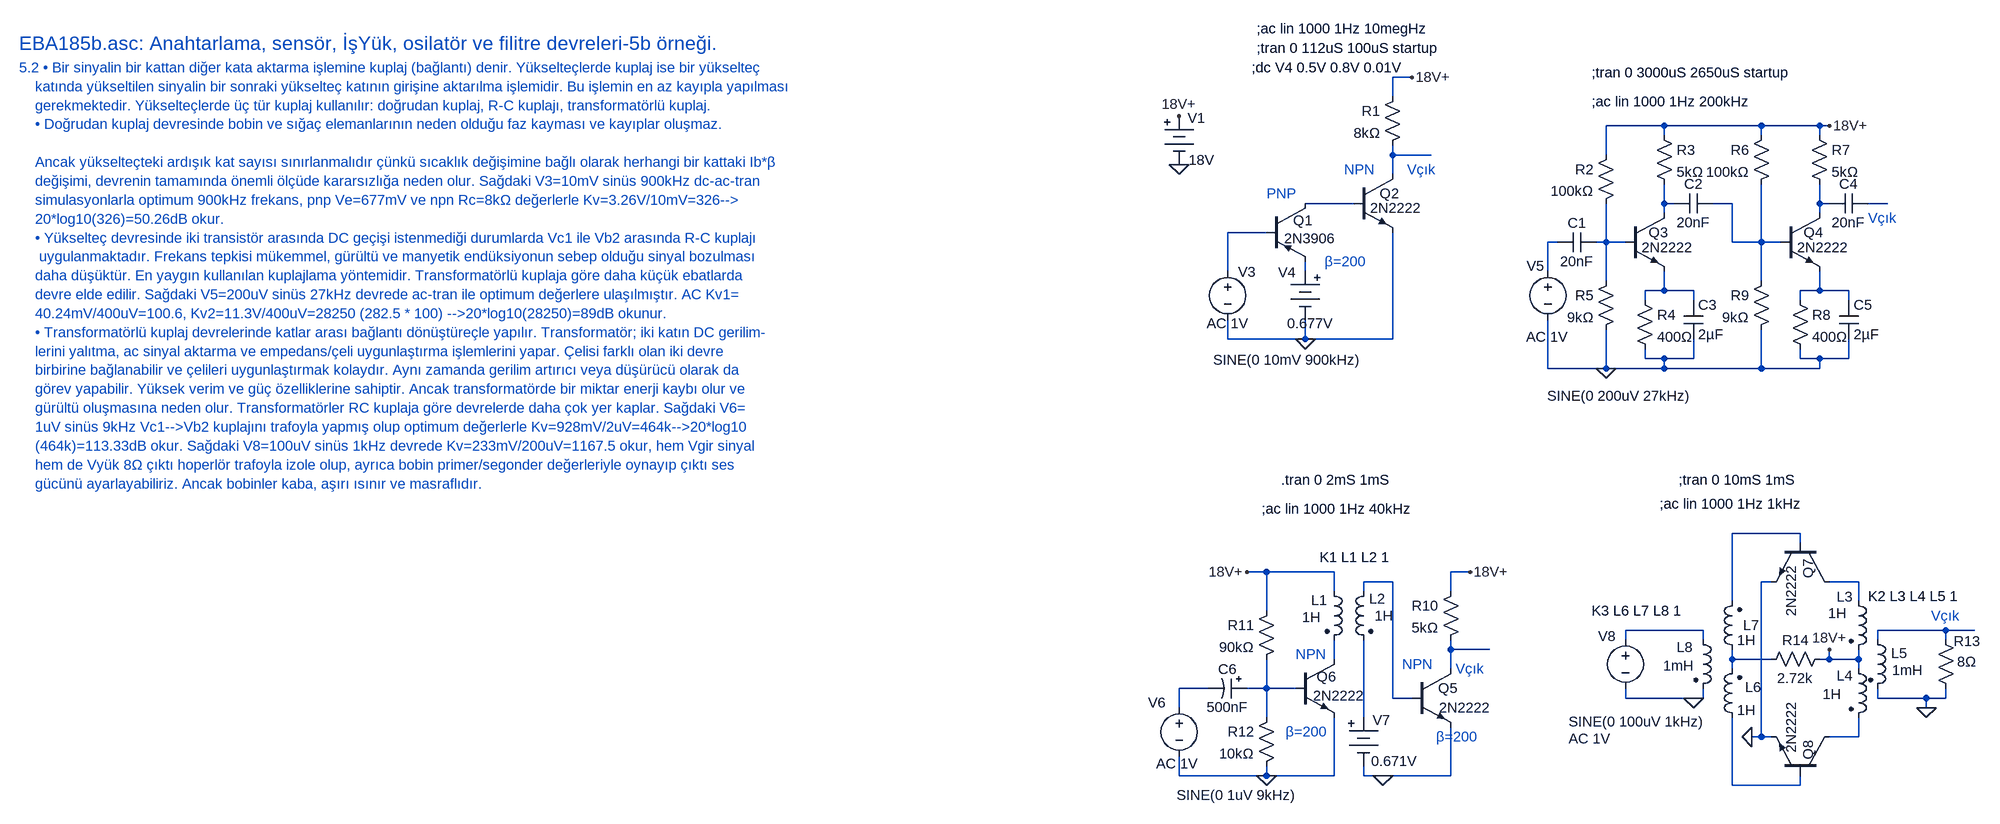
[diagram p0: schematic EBA185b.asc]
EBA185b.asc, the LTspice schematic file:
Version 4
SHEET 1 7064 4332
WIRE 2064 112 2032 112
WIRE 2032 144 2032 112
WIRE 2480 192 2384 192
WIRE 2640 192 2480 192
WIRE 2736 192 2640 192
WIRE 2752 192 2736 192
WIRE 2480 208 2480 192
WIRE 2640 208 2640 192
WIRE 2736 208 2736 192
WIRE 2032 240 2032 224
WIRE 2096 240 2032 240
WIRE 2384 240 2384 192
WIRE 2032 272 2032 240
WIRE 1968 320 1888 320
WIRE 2480 320 2480 288
WIRE 2496 320 2480 320
WIRE 2592 320 2560 320
WIRE 2736 320 2736 288
WIRE 2752 320 2736 320
WIRE 2848 320 2816 320
WIRE 2480 336 2480 320
WIRE 2736 336 2736 320
WIRE 1824 368 1760 368
WIRE 2304 384 2288 384
WIRE 2384 384 2384 320
WIRE 2384 384 2368 384
WIRE 2416 384 2384 384
WIRE 2592 384 2592 320
WIRE 2640 384 2640 288
WIRE 2640 384 2592 384
WIRE 2672 384 2640 384
WIRE 1760 432 1760 368
WIRE 1888 432 1888 416
WIRE 2288 432 2288 384
WIRE 2384 448 2384 384
WIRE 2640 448 2640 384
WIRE 2480 464 2480 432
WIRE 2480 464 2448 464
WIRE 2528 464 2480 464
WIRE 2736 464 2736 432
WIRE 2736 464 2704 464
WIRE 2784 464 2736 464
WIRE 2448 480 2448 464
WIRE 2528 480 2528 464
WIRE 2704 480 2704 464
WIRE 2784 480 2784 464
WIRE 1760 544 1760 512
WIRE 1888 544 1888 512
WIRE 1888 544 1760 544
WIRE 2032 544 2032 368
WIRE 2032 544 1888 544
WIRE 2448 576 2448 560
WIRE 2480 576 2448 576
WIRE 2528 576 2528 544
WIRE 2528 576 2480 576
WIRE 2704 576 2704 560
WIRE 2736 576 2704 576
WIRE 2784 576 2784 544
WIRE 2784 576 2736 576
WIRE 2288 592 2288 512
WIRE 2384 592 2384 528
WIRE 2384 592 2288 592
WIRE 2480 592 2480 576
WIRE 2480 592 2384 592
WIRE 2640 592 2640 528
WIRE 2640 592 2480 592
WIRE 2736 592 2736 576
WIRE 2736 592 2640 592
WIRE 2704 864 2592 864
WIRE 2704 880 2704 864
WIRE 1824 928 1792 928
WIRE 1936 928 1824 928
WIRE 2160 928 2128 928
WIRE 2032 944 1984 944
WIRE 2656 944 2640 944
WIRE 2800 944 2752 944
WIRE 1936 960 1936 928
WIRE 1984 960 1984 944
WIRE 2128 960 2128 928
WIRE 2592 976 2592 864
WIRE 2800 976 2800 944
WIRE 1824 992 1824 928
WIRE 2544 1024 2416 1024
WIRE 2944 1024 2832 1024
WIRE 2992 1024 2944 1024
WIRE 2416 1040 2416 1024
WIRE 2544 1040 2544 1024
WIRE 2832 1040 2832 1024
WIRE 2944 1040 2944 1024
WIRE 2128 1056 2128 1040
WIRE 2192 1056 2128 1056
WIRE 1936 1072 1936 1040
WIRE 2592 1072 2592 1056
WIRE 2656 1072 2592 1072
WIRE 2752 1072 2752 1056
WIRE 2752 1072 2736 1072
WIRE 2800 1072 2800 1056
WIRE 2800 1072 2752 1072
WIRE 2128 1088 2128 1056
WIRE 2592 1088 2592 1072
WIRE 2800 1088 2800 1072
WIRE 1728 1120 1680 1120
WIRE 1824 1120 1824 1072
WIRE 1824 1120 1792 1120
WIRE 1872 1120 1824 1120
WIRE 2032 1136 2032 944
WIRE 2064 1136 2032 1136
WIRE 2416 1136 2416 1120
WIRE 2528 1136 2416 1136
WIRE 2544 1136 2544 1120
WIRE 2544 1136 2528 1136
WIRE 2832 1136 2832 1120
WIRE 2912 1136 2832 1136
WIRE 2944 1136 2944 1120
WIRE 2944 1136 2912 1136
WIRE 1680 1152 1680 1120
WIRE 2912 1152 2912 1136
WIRE 1824 1168 1824 1120
WIRE 1984 1168 1984 1040
WIRE 2640 1200 2640 944
WIRE 2640 1200 2624 1200
WIRE 2656 1200 2640 1200
WIRE 2800 1200 2800 1168
WIRE 2800 1200 2752 1200
WIRE 1680 1264 1680 1232
WIRE 1824 1264 1824 1248
WIRE 1824 1264 1680 1264
WIRE 1936 1264 1936 1168
WIRE 1936 1264 1824 1264
WIRE 1984 1264 1984 1248
WIRE 2016 1264 1984 1264
WIRE 2128 1264 2128 1184
WIRE 2128 1264 2016 1264
WIRE 2592 1280 2592 1168
WIRE 2704 1280 2704 1264
WIRE 2704 1280 2592 1280
FLAG 1680 256 0
FLAG 1680 176 18V+
FLAG 1888 544 0
FLAG 2064 112 18V+
FLAG 2384 592 0
FLAG 2752 192 18V+
FLAG 2016 1264 0
FLAG 1824 1264 0
FLAG 2912 1152 0
FLAG 2528 1136 0
FLAG 2624 1200 0
FLAG 2160 928 18V+
FLAG 1792 928 18V+
FLAG 2752 1056 18V+
SYMBOL Misc\\battery 1680 160 R0
WINDOW 3 16 89 Left 2
WINDOW 0 14 19 Left 2
SYMATTR Value 18V
SYMATTR InstName V1
SYMBOL npn 1968 272 R0
WINDOW 0 43 32 Left 2
WINDOW 3 27 56 Left 2
SYMATTR InstName Q2
SYMATTR Value 2N2222
SYMBOL pnp 1824 320 R0
WINDOW 0 44 28 Left 2
WINDOW 3 29 58 Left 2
SYMATTR InstName Q1
SYMATTR Value 2N3906
SYMBOL res 2048 128 M0
SYMATTR InstName R1
SYMATTR Value 8kΩ
SYMBOL Misc\\battery 1888 416 M0
WINDOW 3 -47 102 Left 2
WINDOW 0 15 18 Left 2
SYMATTR Value 0.677V
SYMATTR InstName V4
SYMBOL voltage 1760 416 M0
WINDOW 0 -32 2 Top 2
WINDOW 3 -98 178 Bottom 2
WINDOW 123 0 118 Bottom 2
WINDOW 39 0 0 Left 0
SYMATTR InstName V3
SYMATTR Value SINE(0 10mV 900kHz)
SYMATTR Value2 AC 1V
SYMBOL npn 2416 336 R0
WINDOW 3 27 57 Left 2
WINDOW 0 38 32 Left 2
SYMATTR Value 2N2222
SYMATTR InstName Q3
SYMBOL res 2400 224 M0
SYMATTR InstName R2
SYMATTR Value 100kΩ
SYMBOL res 2464 192 R0
SYMATTR InstName R3
SYMATTR Value 5kΩ
SYMBOL voltage 2288 416 M0
WINDOW 0 6 7 Left 2
WINDOW 3 -236 222 Left 2
WINDOW 123 -33 124 Left 2
WINDOW 39 0 0 Left 0
SYMATTR InstName V5
SYMATTR Value SINE(0 200uV 27kHz)
SYMATTR Value2 AC 1V
SYMBOL cap 2368 368 R90
WINDOW 0 0 32 VBottom 2
WINDOW 3 32 32 VTop 2
SYMATTR InstName C1
SYMATTR Value 20nF
SYMBOL cap 2560 304 R90
WINDOW 0 0 32 VBottom 2
WINDOW 3 32 32 VTop 2
SYMATTR InstName C2
SYMATTR Value 20nF
SYMBOL res 2432 464 R0
SYMATTR InstName R4
SYMATTR Value 400Ω
SYMBOL cap 2512 480 R0
SYMATTR InstName C3
SYMATTR Value 2µF
SYMBOL res 2400 432 M0
SYMATTR InstName R5
SYMATTR Value 9kΩ
SYMBOL npn 2672 336 R0
WINDOW 3 27 57 Left 2
WINDOW 0 38 32 Left 2
SYMATTR Value 2N2222
SYMATTR InstName Q4
SYMBOL res 2656 192 M0
SYMATTR InstName R6
SYMATTR Value 100kΩ
SYMBOL res 2720 192 R0
SYMATTR InstName R7
SYMATTR Value 5kΩ
SYMBOL cap 2816 304 R90
WINDOW 0 0 32 VBottom 2
WINDOW 3 32 32 VTop 2
SYMATTR InstName C4
SYMATTR Value 20nF
SYMBOL res 2688 464 R0
SYMATTR InstName R8
SYMATTR Value 400Ω
SYMBOL cap 2768 480 R0
SYMATTR InstName C5
SYMATTR Value 2µF
SYMBOL res 2656 432 M0
SYMATTR InstName R9
SYMATTR Value 9kΩ
SYMBOL npn 2064 1088 R0
WINDOW 0 43 32 Left 2
WINDOW 3 45 64 Left 2
SYMATTR InstName Q5
SYMATTR Value 2N2222
SYMBOL res 2144 944 M0
SYMATTR InstName R10
SYMATTR Value 5kΩ
SYMBOL ind2 1920 944 R0
WINDOW 0 -22 31 Left 2
WINDOW 3 -37 59 Left 2
SYMATTR InstName L1
SYMATTR Value 1H
SYMATTR Type ind
SYMBOL ind2 2000 944 M0
WINDOW 0 -20 28 Left 2
WINDOW 3 -33 56 Left 2
SYMATTR InstName L2
SYMATTR Value 1H
SYMATTR Type ind
SYMBOL npn 1872 1072 R0
WINDOW 0 35 29 Left 2
WINDOW 3 29 60 Left 2
SYMATTR InstName Q6
SYMATTR Value 2N2222
SYMBOL res 1840 976 M0
SYMATTR InstName R11
SYMATTR Value 90kΩ
SYMBOL res 1840 1152 M0
SYMATTR InstName R12
SYMATTR Value 10kΩ
SYMBOL voltage 1680 1136 M0
WINDOW 0 36 -8 Top 2
WINDOW 3 -94 176 Bottom 2
WINDOW 123 3 124 Bottom 2
WINDOW 39 0 0 Left 0
SYMATTR InstName V6
SYMATTR Value SINE(0 1uV 9kHz)
SYMATTR Value2 AC 1V
SYMBOL Misc\\battery 1984 1152 R0
WINDOW 3 13 88 Left 2
WINDOW 0 15 21 Left 2
SYMATTR Value 0.671V
SYMATTR InstName V7
SYMBOL npn 2752 880 R90
WINDOW 0 26 34 Left 2
WINDOW 3 37 62 Left 2
SYMATTR InstName Q7
SYMATTR Value 2N2222
SYMBOL npn 2752 1264 M270
WINDOW 0 26 34 Left 2
WINDOW 3 37 62 Left 2
SYMATTR InstName Q8
SYMATTR Value 2N2222
SYMBOL ind2 2784 960 R0
WINDOW 0 -20 9 Left 2
WINDOW 3 -34 36 Left 2
SYMATTR InstName L3
SYMATTR Value 1H
SYMATTR Type ind
SYMBOL ind2 2784 1072 R0
WINDOW 0 -20 27 Left 2
WINDOW 3 -43 58 Left 2
SYMATTR InstName L4
SYMATTR Value 1H
SYMATTR Type ind
SYMBOL ind2 2816 1024 R0
WINDOW 3 40 66 Left 2
WINDOW 0 38 38 Left 2
SYMATTR Value 1mH
SYMATTR InstName L5
SYMATTR Type ind
SYMBOL res 2928 1024 R0
WINDOW 0 29 18 Left 2
WINDOW 3 35 52 Left 2
SYMATTR InstName R13
SYMATTR Value 8Ω
SYMBOL ind2 2608 1184 R180
WINDOW 0 -32 66 Left 2
WINDOW 3 -23 28 Left 2
SYMATTR InstName L6
SYMATTR Value 1H
SYMATTR Type ind
SYMBOL ind2 2608 1072 R180
WINDOW 0 -29 56 Left 2
WINDOW 3 -23 31 Left 2
SYMATTR InstName L7
SYMATTR Value 1H
SYMATTR Type ind
SYMBOL ind2 2528 1024 R0
WINDOW 0 -28 28 Left 2
WINDOW 3 -50 59 Left 2
SYMATTR InstName L8
SYMATTR Value 1mH
SYMATTR Type ind
SYMATTR SpiceLine Rser=1m
SYMBOL res 2752 1056 R90
WINDOW 0 0 56 VBottom 2
WINDOW 3 32 56 VTop 2
SYMATTR InstName R14
SYMATTR Value 2.72k
SYMBOL voltage 2416 1024 R0
WINDOW 0 -45 10 Left 2
WINDOW 3 -94 151 Left 2
WINDOW 123 -94 179 Left 2
WINDOW 39 0 0 Left 0
SYMATTR InstName V8
SYMATTR Value SINE(0 100uV 1kHz)
SYMATTR Value2 AC 1V
SYMBOL polcap 1792 1104 R90
WINDOW 0 0 32 VBottom 2
WINDOW 3 32 32 VTop 2
SYMATTR InstName C6
SYMATTR Value 500nF
TEXT -232 56 Left 3 ;EBA185b.asc: Anahtarlama, sensör, İşYük, osilatör ve filitre devreleri-5b örneği.
TEXT -232 96 Left 2 ;5.2 • Bir sinyalin bir kattan diğer kata aktarma işlemine kuplaj (bağlantı) denir. Yükselteçlerde kuplaj ise bir yükselteç \n    katında yükseltilen sinyalin bir sonraki yükselteç katının girişine aktarılma işlemidir. Bu işlemin en az kayıpla yapılması \n    gerekmektedir. Yükselteçlerde üç tür kuplaj kullanılır: doğrudan kuplaj, R-C kuplajı, transformatörlü kuplaj.\n    • Doğrudan kuplaj devresinde bobin ve sığaç elemanlarının neden olduğu faz kayması ve kayıplar oluşmaz.\n\n    Ancak yükselteçteki ardışık kat sayısı sınırlanmalıdır çünkü sıcaklık değişimine bağlı olarak herhangi bir kattaki Ib*β\n    değişimi, devrenin tamamında önemli ölçüde kararsızlığa neden olur. Sağdaki V3=10mV sinüs 900kHz dc-ac-tran\n    simulasyonlarla optimum 900kHz frekans, pnp Ve=677mV ve npn Rc=8kΩ değerlerle Kv=3.26V/10mV=326-->\n    20*log10(326)=50.26dB okur.\n    • Yükselteç devresinde iki transistör arasında DC geçişi istenmediği durumlarda Vc1 ile Vb2 arasında R-C kuplajı \n     uygulanmaktadır. Frekans tepkisi mükemmel, gürültü ve manyetik endüksiyonun sebep olduğu sinyal bozulması \n    daha düşüktür. En yaygın kullanılan kuplajlama yöntemidir. Transformatörlü kuplaja göre daha küçük ebatlarda \n    devre elde edilir. Sağdaki V5=200uV sinüs 27kHz devrede ac-tran ile optimum değerlere ulaşılmıştır. AC Kv1=\n    40.24mV/400uV=100.6, Kv2=11.3V/400uV=28250 (282.5 * 100) -->20*log10(28250)=89dB okunur.\n    • Transformatörlü kuplaj devrelerinde katlar arası bağlantı dönüştüreçle yapılır. Transformatör; iki katın DC gerilim-\n    lerini yalıtma, ac sinyal aktarma ve empedans/çeli uygunlaştırma işlemlerini yapar. Çelisi farklı olan iki devre \n    birbirine bağlanabilir ve çelileri uygunlaştırmak kolaydır. Aynı zamanda gerilim artırıcı veya düşürücü olarak da \n    görev yapabilir. Yüksek verim ve güç özelliklerine sahiptir. Ancak transformatörde bir miktar enerji kaybı olur ve \n    gürültü oluşmasına neden olur. Transformatörler RC kuplaja göre devrelerde daha çok yer kaplar. Sağdaki V6=\n    1uV sinüs 9kHz Vc1-->Vb2 kuplajını trafoyla yapmış olup optimum değerlerle Kv=928mV/2uV=464k-->20*log10\n    (464k)=113.33dB okur. Sağdaki V8=100uV sinüs 1kHz devrede Kv=233mV/200uV=1167.5 okur, hem Vgir sinyal\n    hem de Vyük 8Ω çıktı hoperlör trafoyla izole olup, ayrıca bobin primer/segonder değerleriyle oynayıp çıktı ses \n    gücünü ayarlayabiliriz. Ancak bobinler kaba, aşırı ısınır ve masraflıdır.
TEXT 1920 416 Left 2 ;β=200
TEXT 2056 264 Left 2 ;Vçık
TEXT 1800 96 Left 2 !;dc V4 0.5V 0.8V 0.01V
TEXT 1808 64 Left 2 !;tran 0 112uS 100uS startup
TEXT 1808 32 Left 2 !;ac lin 1000 1Hz 10megHz
TEXT 1952 264 Left 2 ;NPN
TEXT 1824 304 Left 2 ;PNP
TEXT 2816 344 Left 2 ;Vçık
TEXT 2360 152 Left 2 !;ac lin 1000 1Hz 200kHz
TEXT 2360 104 Left 2 !;tran 0 3000uS 2650uS startup
TEXT 2104 1200 Left 2 ;β=200
TEXT 2136 1088 Left 2 ;Vçık
TEXT 2048 1080 Left 2 ;NPN
TEXT 1912 904 Left 2 !K1 L1 L2 1
TEXT 1872 1064 Left 2 ;NPN
TEXT 1856 1192 Left 2 ;β=200
TEXT 2816 968 Left 2 !K2 L3 L4 L5 1
TEXT 2360 992 Left 2 !K3 L6 L7 L8 1
TEXT 1848 776 Left 2 !.tran 0 2mS 1mS
TEXT 2920 1000 Left 2 ;Vçık
TEXT 1816 824 Left 2 !;ac lin 1000 1Hz 40kHz
TEXT 2472 816 Left 2 !;ac lin 1000 1Hz 1kHz
TEXT 2504 776 Left 2 !;tran 0 10mS 1mS

The netlist it stands for:
* EBA185b.asc
V1 18V+ 0 18V
Q2 N001 N002 0 0 2N2222
Q1 N002 N007 N010 0 2N3906
R1 18V+ N001 8kΩ
V4 N010 0 0.677V
V3 N007 0 SINE(0 10mV 900kHz) AC 1V
Q3 N003 N009 N011 0 2N2222
R2 18V+ N009 100kΩ
R3 18V+ N003 5kΩ
V5 N008 0 SINE(0 200uV 27kHz) AC 1V
C1 N009 N008 20nF
C2 N004 N003 20nF
R4 N011 0 400Ω
C3 N011 0 2µF
R5 N009 0 9kΩ
Q4 N005 N004 N012 0 2N2222
R6 18V+ N004 100kΩ
R7 18V+ N005 5kΩ
C4 N006 N005 20nF
R8 N012 0 400Ω
C5 N012 0 2µF
R9 N004 0 9kΩ
Q5 N018 N014 0 0 2N2222
R10 18V+ N018 5kΩ
L1 18V+ N019 1H
L2 N014 N023 1H
Q6 N019 N022 0 0 2N2222
R11 18V+ N022 90kΩ
R12 N022 0 10kΩ
V6 N021 0 SINE(0 1uV 9kHz) AC 1V
V7 N023 0 0.671V
Q7 N015 N013 0 0 2N2222
Q8 N024 N025 0 0 2N2222
L3 N015 18V+ 1H
L4 18V+ N024 1H
L5 N017 0 1mH
R13 N017 0 8Ω
L6 N025 N020 1H
L7 N020 N013 1H
L8 N016 0 1mH Rser=1m
R14 18V+ N020 2.72k
V8 N016 0 SINE(0 100uV 1kHz) AC 1V
C6 N022 N021 500nF
.model NPN NPN
.model PNP PNP
.lib standard.bjt
* EBA185b.asc: Anahtarlama, sensör, İşYük, osilatör ve filitre devreleri-5b örneği.
* 5.2 • Bir sinyalin bir kattan diğer kata aktarma işlemine kuplaj (bağlantı) denir. Yükselteçlerde kuplaj ise bir yükselteç
*     katında yükseltilen sinyalin bir sonraki yükselteç katının girişine aktarılma işlemidir. Bu işlemin en az kayıpla yapılması
*     gerekmektedir. Yükselteçlerde üç tür kuplaj kullanılır: doğrudan kuplaj, R-C kuplajı, transformatörlü kuplaj.
*     • Doğrudan kuplaj devresinde bobin ve sığaç elemanlarının neden olduğu faz kayması ve kayıplar oluşmaz.
*     Ancak yükselteçteki ardışık kat sayısı sınırlanmalıdır çünkü sıcaklık değişimine bağlı olarak herhangi bir kattaki Ib*β
*     değişimi, devrenin tamamında önemli ölçüde kararsızlığa neden olur. Sağdaki V3=10mV sinüs 900kHz dc-ac-tran
*     simulasyonlarla optimum 900kHz frekans, pnp Ve=677mV ve npn Rc=8kΩ değerlerle Kv=3.26V/10mV=326-->
*     20*log10(326)=50.26dB okur.
*     • Yükselteç devresinde iki transistör arasında DC geçişi istenmediği durumlarda Vc1 ile Vb2 arasında R-C kuplajı
*      uygulanmaktadır. Frekans tepkisi mükemmel, gürültü ve manyetik endüksiyonun sebep olduğu sinyal bozulması
*     daha düşüktür. En yaygın kullanılan kuplajlama yöntemidir. Transformatörlü kuplaja göre daha küçük ebatlarda
*     devre elde edilir. Sağdaki V5=200uV sinüs 27kHz devrede ac-tran ile optimum değerlere ulaşılmıştır. AC Kv1=
*     40.24mV/400uV=100.6, Kv2=11.3V/400uV=28250 (282.5 * 100) -->20*log10(28250)=89dB okunur.
*     • Transformatörlü kuplaj devrelerinde katlar arası bağlantı dönüştüreçle yapılır. Transformatör; iki katın DC gerilim-
*     lerini yalıtma, ac sinyal aktarma ve empedans/çeli uygunlaştırma işlemlerini yapar. Çelisi farklı olan iki devre
*     birbirine bağlanabilir ve çelileri uygunlaştırmak kolaydır. Aynı zamanda gerilim artırıcı veya düşürücü olarak da
*     görev yapabilir. Yüksek verim ve güç özelliklerine sahiptir. Ancak transformatörde bir miktar enerji kaybı olur ve
*     gürültü oluşmasına neden olur. Transformatörler RC kuplaja göre devrelerde daha çok yer kaplar. Sağdaki V6=
*     1uV sinüs 9kHz Vc1-->Vb2 kuplajını trafoyla yapmış olup optimum değerlerle Kv=928mV/2uV=464k-->20*log10
*     (464k)=113.33dB okur. Sağdaki V8=100uV sinüs 1kHz devrede Kv=233mV/200uV=1167.5 okur, hem Vgir sinyal
*     hem de Vyük 8Ω çıktı hoperlör trafoyla izole olup, ayrıca bobin primer/segonder değerleriyle oynayıp çıktı ses
*     gücünü ayarlayabiliriz. Ancak bobinler kaba, aşırı ısınır ve masraflıdır.
* β=200
* Vçık
;dc V4 0.5V 0.8V 0.01V
;tran 0 112uS 100uS startup
;ac lin 1000 1Hz 10megHz
* NPN
* PNP
* Vçık
;ac lin 1000 1Hz 200kHz
;tran 0 3000uS 2650uS startup
* β=200
* Vçık
* NPN
K1 L1 L2 1
* NPN
* β=200
K2 L3 L4 L5 1
K3 L6 L7 L8 1
.tran 0 2mS 1mS
* Vçık
;ac lin 1000 1Hz 40kHz
;ac lin 1000 1Hz 1kHz
;tran 0 10mS 1mS
.backanno
.end